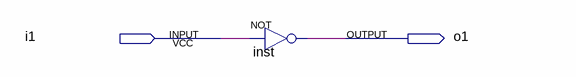
[diagram p0: schematic sheet]
// Quartus schematic not_1.bdf as structural Verilog: 1 symbols, 2 pins
module not_1 (
  input  i1,
  output o1
);

  not inst (o1, i1);
endmodule
